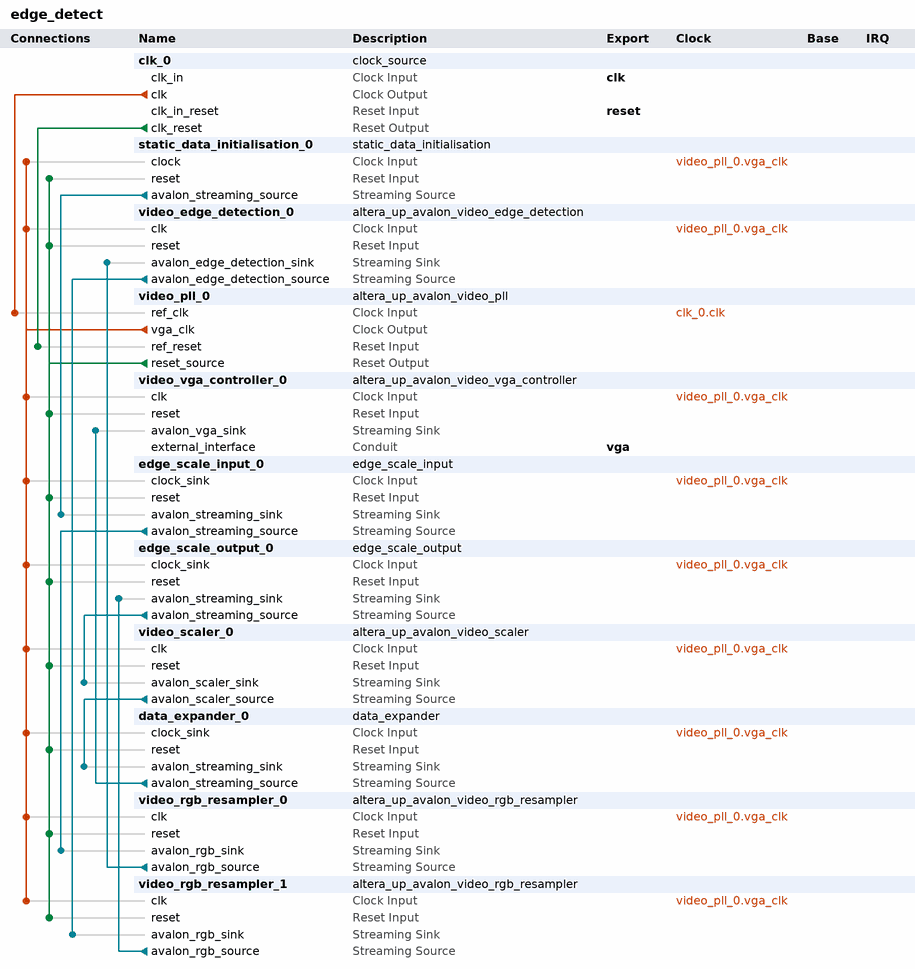
[diagram p0: system contents]
# Platform Designer (Qsys) system edge_detect, Cyclone IV E EP4CE115F29C7
# Parameters at their usual value, and those the tool derives, are not listed.
package require -exact qsys 18.0
create_system edge_detect
set_project_property DEVICE_FAMILY {Cyclone IV E}
set_project_property DEVICE EP4CE115F29C7

add_instance clk_0 clock_source 20.1
set_instance_parameter_value clk_0 clockFrequency 50000000

add_instance static_data_initialisation_0 static_data_initialisation 1.0

add_instance video_edge_detection_0 altera_up_avalon_video_edge_detection 18.0
set_instance_parameter_value video_edge_detection_0 intensity 1
set_instance_parameter_value video_edge_detection_0 width 320

add_instance video_pll_0 altera_up_avalon_video_pll 18.0
set_instance_parameter_value video_pll_0 camera {5MP Digital Camera (THDB_D5M)}
set_instance_parameter_value video_pll_0 gui_refclk 50.0
set_instance_parameter_value video_pll_0 lcd {7" LCD on VEEK-MT and MTL/MTL2 Modules}

add_instance video_vga_controller_0 altera_up_avalon_video_vga_controller 18.0
set_instance_parameter_value video_vga_controller_0 board DE2-115
set_instance_parameter_value video_vga_controller_0 resolution {VGA 640x480}

add_instance edge_scale_input_0 edge_scale_input 1.0

add_instance edge_scale_output_0 edge_scale_output 1.0

add_instance video_scaler_0 altera_up_avalon_video_scaler 18.0
set_instance_parameter_value video_scaler_0 color_bits 4
set_instance_parameter_value video_scaler_0 color_planes 3
set_instance_parameter_value video_scaler_0 height_scaling 2
set_instance_parameter_value video_scaler_0 include_channel true
set_instance_parameter_value video_scaler_0 width_in 320
set_instance_parameter_value video_scaler_0 width_scaling 2

add_instance data_expander_0 data_expander 1.0

add_instance video_rgb_resampler_0 altera_up_avalon_video_rgb_resampler 18.0
set_instance_parameter_value video_rgb_resampler_0 alpha 1023
set_instance_parameter_value video_rgb_resampler_0 input_type {24-bit RGB}
set_instance_parameter_value video_rgb_resampler_0 output_type {8-bit Grayscale}

add_instance video_rgb_resampler_1 altera_up_avalon_video_rgb_resampler 18.0
set_instance_parameter_value video_rgb_resampler_1 alpha 1023
set_instance_parameter_value video_rgb_resampler_1 input_type {8-bit Grayscale}
set_instance_parameter_value video_rgb_resampler_1 output_type {24-bit RGB}

# connections
add_connection clk_0.clk video_pll_0.ref_clk clock
add_connection video_pll_0.vga_clk data_expander_0.clock_sink clock
add_connection video_pll_0.vga_clk edge_scale_input_0.clock_sink clock
add_connection video_pll_0.vga_clk edge_scale_output_0.clock_sink clock
add_connection video_pll_0.vga_clk static_data_initialisation_0.clock clock
add_connection video_pll_0.vga_clk video_edge_detection_0.clk clock
add_connection video_pll_0.vga_clk video_rgb_resampler_0.clk clock
add_connection video_pll_0.vga_clk video_rgb_resampler_1.clk clock
add_connection video_pll_0.vga_clk video_scaler_0.clk clock
add_connection video_pll_0.vga_clk video_vga_controller_0.clk clock
add_connection clk_0.clk_reset video_pll_0.ref_reset reset
add_connection video_pll_0.reset_source data_expander_0.reset reset
add_connection video_pll_0.reset_source edge_scale_input_0.reset reset
add_connection video_pll_0.reset_source edge_scale_output_0.reset reset
add_connection video_pll_0.reset_source static_data_initialisation_0.reset reset
add_connection video_pll_0.reset_source video_edge_detection_0.reset reset
add_connection video_pll_0.reset_source video_rgb_resampler_0.reset reset
add_connection video_pll_0.reset_source video_rgb_resampler_1.reset reset
add_connection video_pll_0.reset_source video_scaler_0.reset reset
add_connection video_pll_0.reset_source video_vga_controller_0.reset reset
add_connection data_expander_0.avalon_streaming_source video_vga_controller_0.avalon_vga_sink avalon_streaming
add_connection edge_scale_input_0.avalon_streaming_source video_rgb_resampler_0.avalon_rgb_sink avalon_streaming
add_connection edge_scale_output_0.avalon_streaming_source video_scaler_0.avalon_scaler_sink avalon_streaming
add_connection static_data_initialisation_0.avalon_streaming_source edge_scale_input_0.avalon_streaming_sink avalon_streaming
add_connection video_edge_detection_0.avalon_edge_detection_source video_rgb_resampler_1.avalon_rgb_sink avalon_streaming
add_connection video_rgb_resampler_0.avalon_rgb_source video_edge_detection_0.avalon_edge_detection_sink avalon_streaming
add_connection video_rgb_resampler_1.avalon_rgb_source edge_scale_output_0.avalon_streaming_sink avalon_streaming
add_connection video_scaler_0.avalon_scaler_source data_expander_0.avalon_streaming_sink avalon_streaming

# exported interfaces
add_interface clk clock sink
set_interface_property clk EXPORT_OF clk_0.clk_in
add_interface reset reset sink
set_interface_property reset EXPORT_OF clk_0.clk_in_reset
add_interface vga conduit end
set_interface_property vga EXPORT_OF video_vga_controller_0.external_interface

set_interconnect_requirement {$system} qsys_mm.clockCrossingAdapter HANDSHAKE
set_interconnect_requirement {$system} qsys_mm.enableEccProtection FALSE
set_interconnect_requirement {$system} qsys_mm.insertDefaultSlave FALSE
set_interconnect_requirement {$system} qsys_mm.maxAdditionalLatency 1

save_system edge_detect.qsys
